# Altium schematic sheet Power.SchDoc
size A4; SheetNumber: 1; SheetTotal: 3
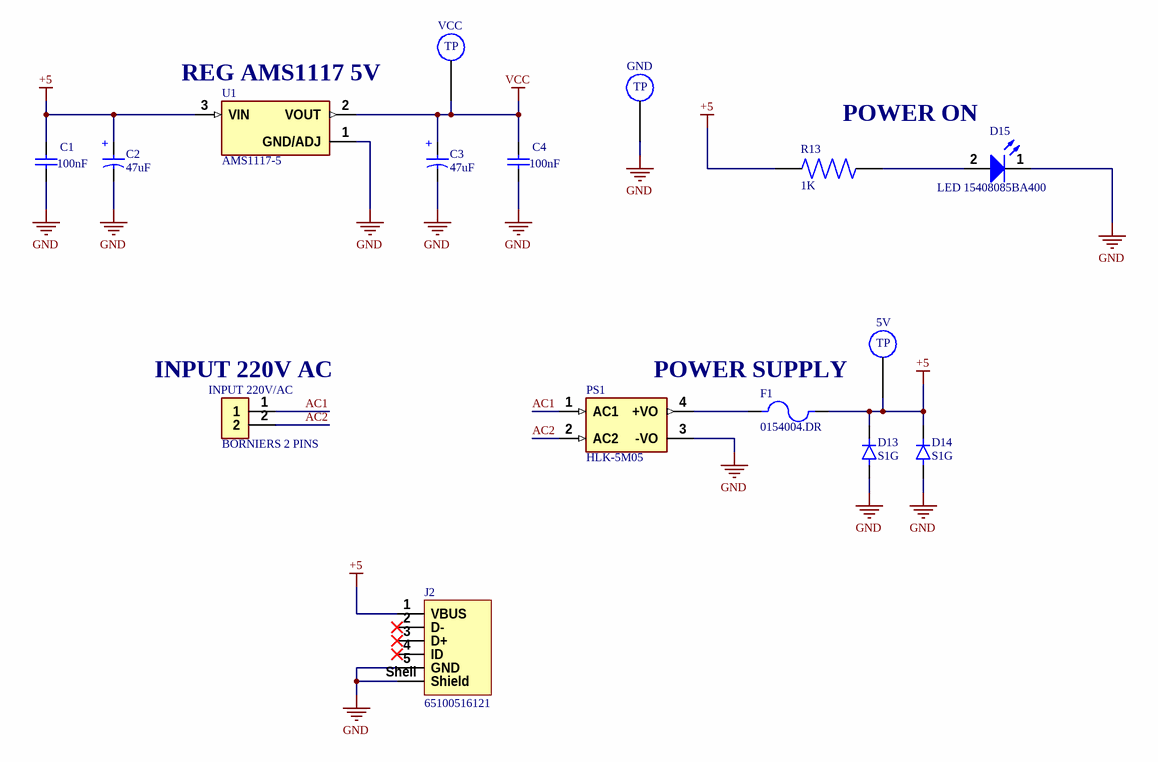
[diagram p0: Power.SchDoc]

## Parts
5V  TEST POINT  [TEST POINT]  (value not drawn)  (no BOM)
C1  100nF  [WCAP-CSGP_0603_L1.6W0.8H0.8_Reflow]
C2  Capacitance: 47uF  [Cap 865080443007]  (hidden comment: Cap 865080443007)
C3  Capacitance: 47uF  [Cap 865080443007]  (hidden comment: Cap 865080443007)
C4  100nF  [WCAP-CSGP_0603_L1.6W0.8H0.8_Reflow]
D13  S1G  [S1G]
D14  S1G  [S1G]
D15  LED 15408085BA400  [LED 15408085BA400]
F1  0154004.DR  [0154004.DR]
GND  TEST POINT  [TEST POINT]  (value not drawn)  (no BOM)
INPUT_220V/AC  BORNIERS 2 PINS  [BORNIERS 2 PINS]
J2  65100516121  [WR-USB-65100516121]
PS1  HLK-5M05  [HLK-5M05]
R13  1K  [RES FCR1206J10R]
U1  AMS1117-5  [AMS1117-5]
VCC  TEST POINT  [TEST POINT]  (value not drawn)  (no BOM)

## Nets
+5: 5V.1 C1.2 C2.1(P) D13.1(K) D14.1(K) F1.2 J2.1(VBUS) R13.1 U1.3(VIN)
GND: C1.1 C2.2(N) C3.2(N) C4.1 D13.2(A) D14.2(A) D15.1(K) GND.1 J2.5(GND) J2.Shell(Shield) PS1.3(-VO) U1.1(GND/ADJ)
VCC: C3.1(P) C4.2 U1.2(VOUT) VCC.1
AC1: INPUT_220V/AC.1 PS1.1(AC1)
AC2: INPUT_220V/AC.2 PS1.2(AC2)
NetD15_2: D15.2(A) R13.2
NetF1_1: F1.1 PS1.4(+VO)

Not connected (* = marked no-connect by the designer): J2 2(D-)* 3(D+)* 4(ID)*

## Notes on the sheet
- (near VCC) VCC
- (near U1) REG AMS1117 5V
- (near GND) GND
- (near R13) POWER ON
- (near 5V) 5V
- (near INPUT_220V/AC) INPUT 220V AC
- POWER SUPPLY
- (in symbol Cap 865080443007) +
- (in symbol TEST POINT) TP

## Library data of the parts
C1 C4 = 885012206071: WCAP-CSGP Multilayer Ceramic Chip Capacitor, General Purpose, size 0603, 100nF, 25V; Manufacturer: Wurth Elektronik; Case/Size Code: 0603; Capacitance Tolerance: +/-10%; Ceramic Type: X7R; Dissipation Factor: 3.5%; Insulation Resistance: 5GΩ; Technical Reference: X7R0603104K025DFCT10000; Manufacturer Part Number: 885012206071; Category: Multilayer Ceramic Chip Capacitors; Match Code: WCAP-CSGP; ComponentLink1Description: Website Link; ComponentLink1URL: https://www.we-online.com/redexpert/article/885012206071?ad; ComponentLink2Description: Datasheet Link; ComponentLink2URL: https://www.we-online.com/redexpert/spec/885012206071?ad; Mount: Surface Mount; Min Operating Temperature: -55°C; Max Operating Temperature: 125°C; Packaging: Tape and Reel; Length: 1.6mm; Width: 0.8mm; Height: 0.8mm; Capacitance: 100nF; Rated Voltage (DC): 25V
C2 C3 = Cap 865080443007: WCAP-ASLI Aluminum Electrolytic Capacitor, V-Chip, D6.3 x H5.5mm, 47uF, 25V; Manufacturer: Wurth Elektronik; Capacitance Tolerance: +/-20%; Dissipation Factor: 14%; Endurance: 2000h; Leakage Current: 11.75uA; Ripple Current: 220mA; Technical Reference: ASED055470M025DVCTBB000; Manufacturer Part Number: 865080443007; Category: Aluminum Electrolytic Capacitors; Match Code: WCAP-ASLI; ComponentLink1Description: Website Link; ComponentLink1URL: https://www.we-online.com/redexpert/article/865080443007?ad; ComponentLink2Description: Datasheet Link; ComponentLink2URL: https://www.we-online.com/redexpert/spec/865080443007?ad; Mount: Surface Mount; Operating Temperature Max: 105°C; Operating Temperature Min: -55°C; Packaging: Tape and Reel; Height: 5.5mm; Diameter: 6.3mm; Rated Voltage (DC): 25V
D13 D14 = S1G: Diode Standard 400 V 1A Surface Mount DO-214AC (SMA); MF: ON Semiconductor; SnapEDA_Link: https://www.snapeda.com/parts/S1G/Onsemi/view-part/?ref=snap; Package: SMA-2 ON Semiconductor; Value: *; MP: S1G; Check_prices: https://www.snapeda.com/parts/S1G/Onsemi/view-part/?ref=eda
D15 = LED 15408085BA400: SMT Infrared Chip LED Infrared Waterclear, body 2x1.3mm, size 0805, Infrared, 1.4V, 140°; Manufacturer: Wurth Elektronik; Match Code: WL-SICW; Case/Size Code: 0805; Centroid Wavelength: 845nm; Chip Technology: AlGaAs; Forward Voltage Max: 2V; Peak Wavelength: 850nm; Radiant Intensity: 1.5mW/sr; Radiant Intensity Min: 0.6mW/sr; Manufacturer Part Number: 15408085BA400; Category: Infrared LEDs; ComponentLink1Description: Website Link; ComponentLink1URL: https://www.we-online.com/redexpert/article/15408085BA400?ad; ComponentLink2Description: Datasheet Link; ComponentLink2URL: https://www.we-online.com/redexpert/spec/15408085BA400?ad; Mount: Surface Mount; Operating Temperature Max: 85°C; Operating Temperature Min: -40°C; Packaging: Tape and Reel; Length: 2mm; Width: 1.3mm; Height: 0.8mm; Emitting Color: Infrared; Forward Voltage: 1.4V; Viewing Angle: 140°
F1 = 0154004.DR: Nano2 SMD FF submin fuse w/holder, 4A | Littelfuse 0154004.DR; MF: Littelfuse Inc.; SnapEDA_Link: https://www.snapeda.com/parts/0154004.DR/Littelfuse/view-part/?ref=snap; Package: SMD-2 Littelfuse; Value: *; MP: 0154004.DR; Check_prices: https://www.snapeda.com/parts/0154004.DR/Littelfuse/view-part/?ref=eda
INPUT_220V/AC = BORNIERS 2 PINS: Terminal Block Connector Wire Receptacle 2
J2 = WR-USB-65100516121: WR-COM Mini USB 2.0 Type B SMT Horizontal 5 Contacts; Manufacturer: Wurth Elektronik; Match Code: WR-USB; Gender: Receptacle; Interface Type: Type B; Number of Ports: 1; Rated Current: 1A; Working Voltage: 30V (AC); Manufacturer Part Number: 65100516121; Category: Input/Output Connectors; ComponentLink1Description: Website Link; ComponentLink1URL: https://www.we-online.com/redexpert/article/65100516121?ad; ComponentLink2Description: Datasheet Link; ComponentLink2URL: https://www.we-online.com/redexpert/spec/65100516121?ad; Mount: Surface Mount; Min Operating Temperature: -40°C; Max Operating Temperature: 105°C; Packaging: Tape and Reel & Mylar; Application: Mini USB 2.0; Number of Pins: 5; Orientation: Horizontal
PS1 = HLK-5M05: AC-DC Power Supply Module HLK-5M05 220V to 5V 1A; MF: {'manufacturer': u'Hi-link'}; Package: None; Price: None; Value: *; MP: HLK-5M05; Availability: Unavailable
R13 = RES FCR1206J10R: RES 1206 10 Ohm 5% 1/8W ±500ppm/°C Molded SMD SMD T/R; Resistance: 10; Power_Rating: .125 W; MF: TE Connectivity; DigiKey-Purchase-URL: https://snapeda.com/shop?store=DigiKey&id=988597; Package: 1206; EU_RoHS_Compliance: Compliant with Exemptions; Tolerance: 5%; Value: *; MP: FCR1206J10R; Price: None; SnapEDA_Link: https://www.snapeda.com/parts/FCR1206J10R/TE%20Connectivity%20Passive%20Product/view-part/988597/?ref=snap; Mouser-Purchase-URL: https://snapeda.com/shop?store=Mouser&id=988597; Availability: Warning
U1 = AMS1117-5: Sot223/Pkg 1-Amp 5-Volt Low Drop Out Voltage Regulatator; MF: Advanced Monolithic Systems; MP: AMS1117-3.3; SnapEDA_Link: https://www.snapeda.com/parts/AMS1117-3.3/Advanced+Monolithic+Systems/view-part/?ref=snap; Package: SOT-223 Seeed Technology; Value: *; Check_prices: https://www.snapeda.com/parts/AMS1117-3.3/Advanced+Monolithic+Systems/view-part/?ref=eda